# EAGLE design BoardNeu (EAGLE 9.6.2)
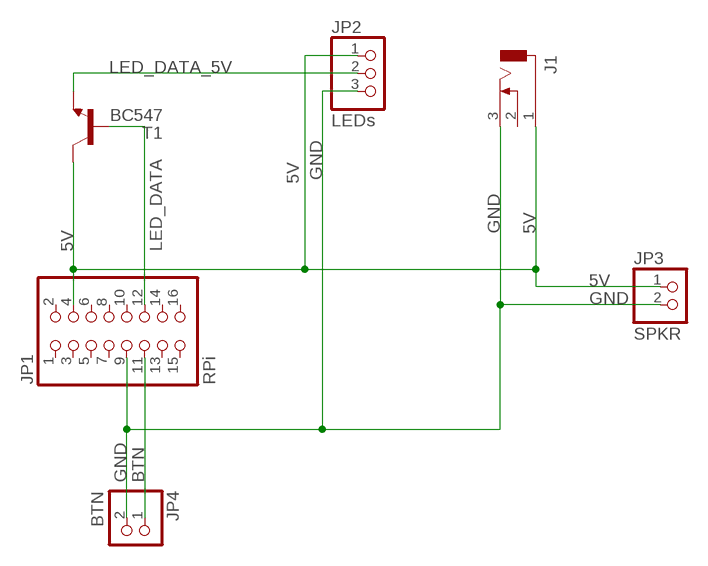
[diagram p0: schematic, sheet 1]

## Parts
J1  DCJ0303  [DCJ0303]
JP1  RPi  PINHD-2X8  [2X08]
JP2  LEDs  PINHD-1X3  [1X03]
JP3  SPKR  PINHD-1X2  [1X02]
JP4  BTN  PINHD-1X2  [1X02]
T1  BC547  [TO92]

## Nets
5V: J1.1 JP1.4 JP2.1 JP3.1 T1.3(C)
BTN: JP1.11 JP4.1
GND: J1.3 JP1.9 JP2.3 JP3.2 JP4.2
LED_DATA: JP1.12 T1.2(B)
LED_DATA_5V: JP2.2 T1.1(E)
Unconnected: J1.2 JP1.1 JP1.2 JP1.3 JP1.5 JP1.6 JP1.7 JP1.8 JP1.10 JP1.13 JP1.14 JP1.15 JP1.16

## Library data of the parts
J1 = con-jack:DCJ0303: DC POWER JACK Source: DCJ0303.pdf; OC_FARNELL: unknown; OC_NEWARK: unknown
JP1 = pinhead:PINHD-2X8: PIN HEADER
JP2 = pinhead:PINHD-1X3: PIN HEADER
JP3 JP4 = pinhead:PINHD-1X2: PIN HEADER
T1 = transistor:BC547: NPN TRANSISTOR

## Net classes
0 default: clearance 0.205 mm

## Board
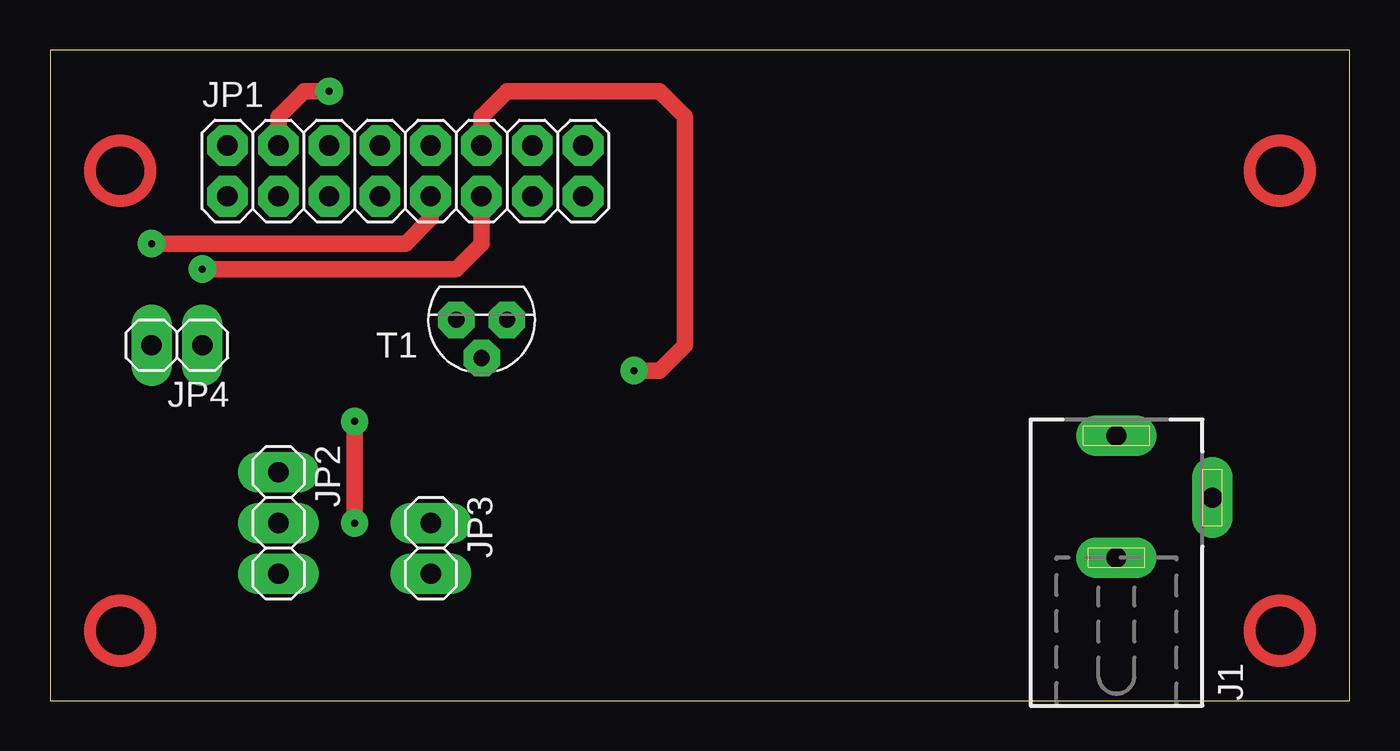
[diagram p1: board, top side]
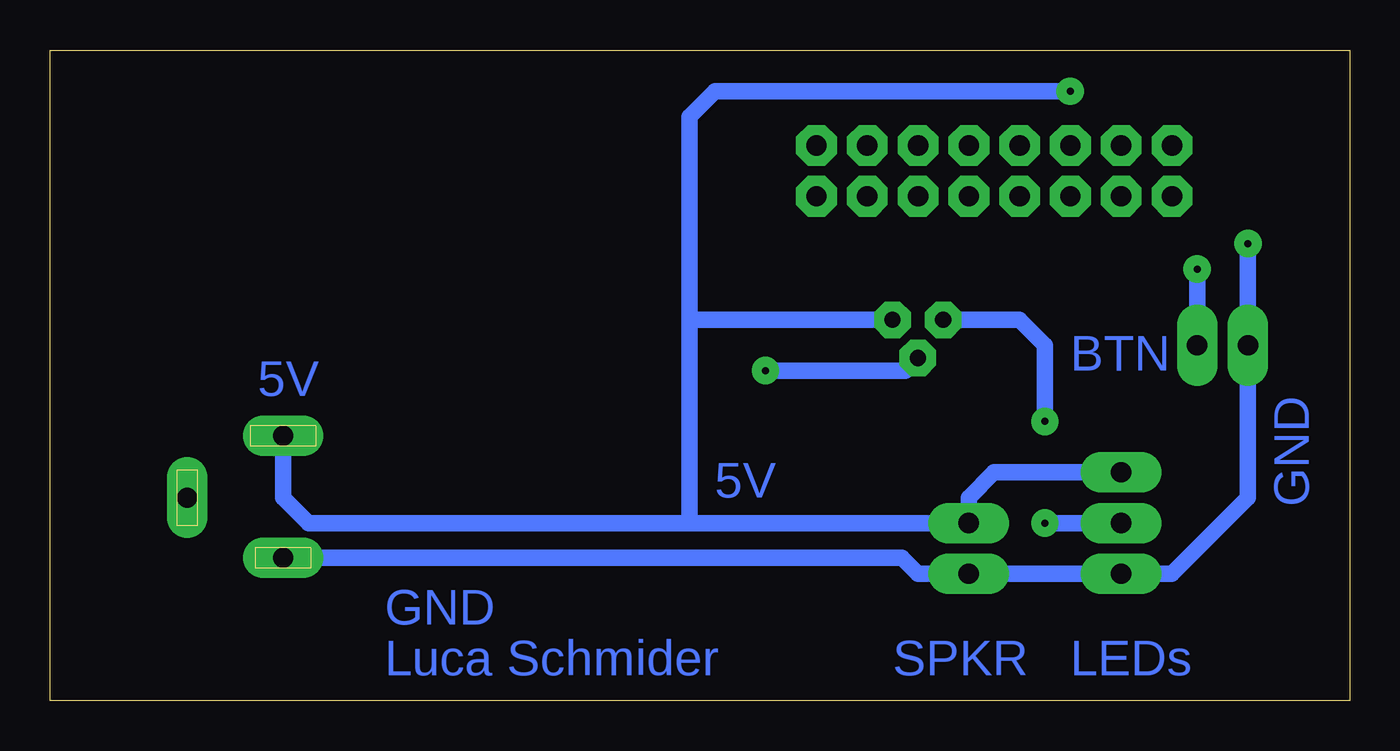
[diagram p2: board, bottom side, seen from below]

Size 65 x 32.54 mm. Coordinates in mm from the lower left corner, seen from the top.
Outline: 0,0 65,0 65,32.54 0,32.54 0,0
Copper layers (1*16): Top 0.035mm / dielectric 1.5mm / Bottom 0.035mm
Design rules "default *": minimum track width 6mil, minimum drill 0.35mm, track to track 6mil, track to pad 6mil, pad to pad 6mil, via to via 6mil, smd to smd 6mil, copper to edge 40mil, drill to drill 6mil, minimum pad ring 20mil, minimum via ring 20mil, stop-mask expansion 4mil, vias tented up to drill 0mil, thermal gap 10mil

### Footprints (pad centres in the part's own frame; a part is rotated, then mirrored left to right if it is on the bottom)
DCJ0303 = drill 1 pad 2 long: 1 0,3.1; 2 4.8,0; 3 0,-3
2X08 = drill 1.016 octagon: 1 -8.89,-1.27; 2 -8.89,1.27; 3 -6.35,-1.27; 4 -6.35,1.27; 5 -3.81,-1.27; 6 -3.81,1.27; 7 -1.27,-1.27; 8 -1.27,1.27; 9 1.27,-1.27; 10 1.27,1.27; 11 3.81,-1.27; 12 3.81,1.27; 13 6.35,-1.27; 14 6.35,1.27; 15 8.89,-1.27; 16 8.89,1.27
1X03 = drill 1.016 long: 1 -2.54,0; 2 0,0; 3 2.54,0
1X02 = drill 1.016 long: 1 -1.27,0; 2 1.27,0
TO92 = drill 0.813 octagon: 1 1.27,0; 2 0,1.905; 3 -1.27,0

### Placement (x,y rotation side)
J1  53.34,10.16 0 top
JP1  17.77,26.5 0 top
JP2  11.43,8.89 270 top
JP3  19.05,7.62 270 top
JP4  6.35,17.78 180 top
T1  21.59,19.05 180 top

### Tracks (layer width: path | path; a pad name or v marks a point on that pad's centre or on a via)
5V  (via drill 0.35)
  Top 0.61: JP1.4
  Top 0.813: JP1.4 11.43,29.21 12.7,30.48 v13.97,30.48
  Bottom 0.813: J1.1 53.34,10.16 52.07,8.89 33.02,8.89 | 33.02,8.89 JP3.1 19.05,10.16 17.78,11.43 JP2.1 | v13.97,30.48 31.75,30.48 33.02,29.21 33.02,19.05 | 33.02,19.05 33.02,8.89 | T1.3 33.02,19.05
BTN  (via drill 0.35)
  Top 0.61: JP1.11
  Top 0.813: JP1.11 21.59,22.86 20.32,21.59 v7.62,21.59
  Bottom 0.813: v7.62,21.59 JP4.1
GND  (via drill 0.35)
  Top 0.813: JP1.9 19.04,24.12 17.78,22.86 v5.08,22.86
  Bottom 0.813: J1.3 22.4,7.16 21.59,6.35 JP3.2 JP2.3 8.89,6.35 5.08,10.16 JP4.2 v5.08,22.86
LED_DATA  (via drill 0.35)
  Top 0.813: JP1.12 21.58,29.2 22.86,30.48 30.48,30.48 31.75,29.21 31.75,17.78 30.48,16.51 v29.21,16.51
  Bottom 0.813: v29.21,16.51 22.23,16.51 T1.2
LED_DATA_5V  (via drill 0.35)
  Top 0.813: v15.24,8.89 v15.24,13.97
  Bottom 0.813: JP2.2 v15.24,8.89 | T1.1 16.51,19.05 15.24,17.78 v15.24,13.97
(copper drawn outside any net)
  shapes: Top circle x4

### Text on the board
Bottom: BTN | GND | 5V | 5V | GND | LEDs | SPKR | Luca Schmider